# EAGLE design B104C (EAGLE 6.6.0)
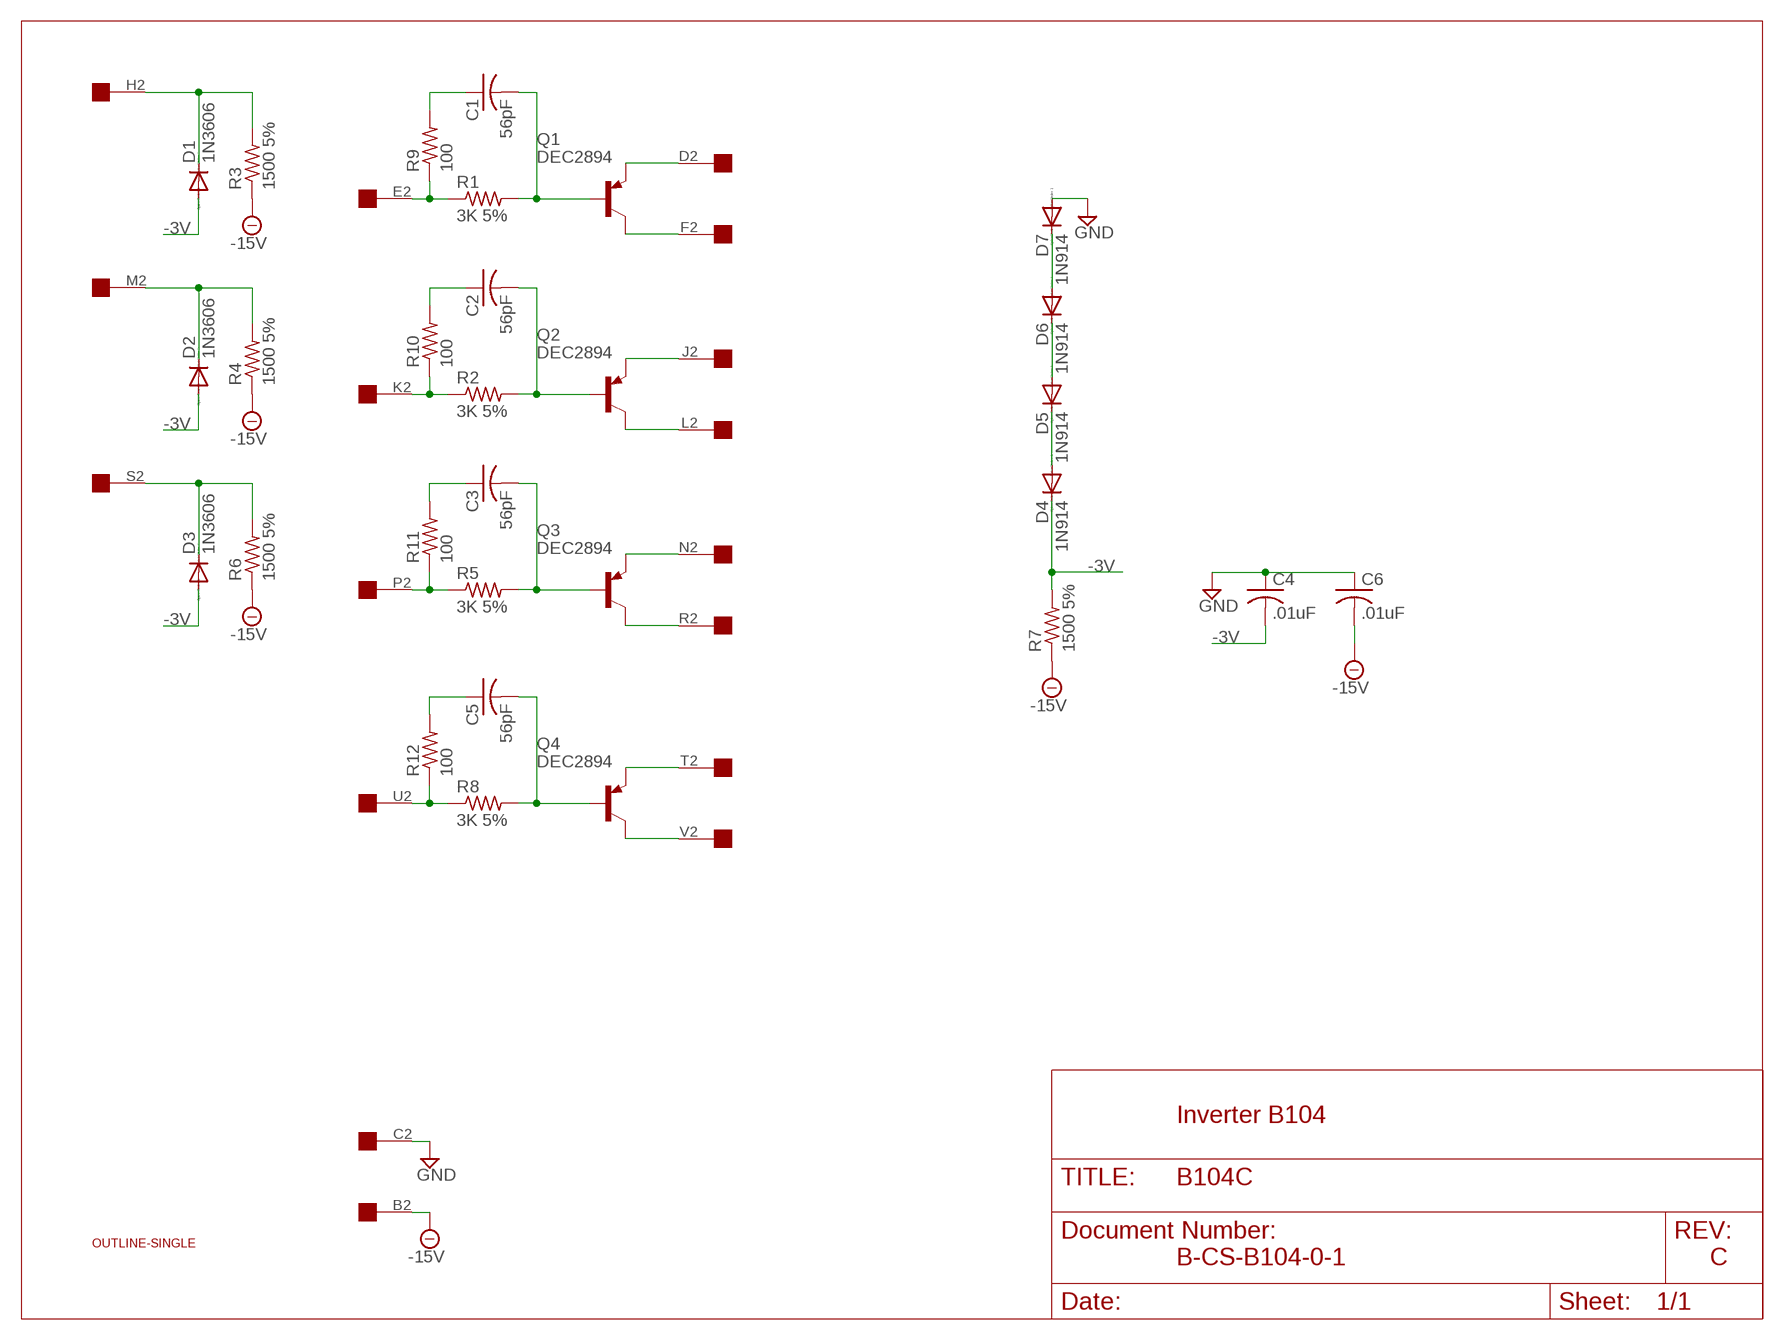
[diagram p0: schematic, sheet 1]

## Parts
C1  56pF  C-US150-054X183  [C150-054X183]
C2  56pF  C-US150-054X183  [C150-054X183]
C3  56pF  C-US150-054X183  [C150-054X183]
C4  .01uF  C-US150-054X183  [C150-054X183]
C5  56pF  C-US150-054X183  [C150-054X183]
C6  .01uF  C-US150-054X183  [C150-054X183]
D1  1N3606  1N4148DO35-10  [DO35-10]
D2  1N3606  1N4148DO35-10  [DO35-10]
D3  1N3606  1N4148DO35-10  [DO35-10]
D4  1N914  1N4148DO35-10  [DO35-10]
D5  1N914  1N4148DO35-10  [DO35-10]
D6  1N914  1N4148DO35-10  [DO35-10]
D7  1N914  1N4148DO35-10  [DO35-10]
Q1  DEC2894  2N2904  [TO39]
Q2  DEC2894  2N2904  [TO39]
Q3  DEC2894  2N2904  [TO39]
Q4  DEC2894  2N2904  [TO39]
R1  3K 5%  R-US_0207/10  [0207/10]
R2  3K 5%  R-US_0207/10  [0207/10]
R3  1500 5%  R-US_0207/10  [0207/10]
R4  1500 5%  R-US_0207/10  [0207/10]
R5  3K 5%  R-US_0207/10  [0207/10]
R6  1500 5%  R-US_0207/10  [0207/10]
R7  1500 5%  R-US_0207/10  [0207/10]
R8  3K 5%  R-US_0207/10  [0207/10]
R9  100  R-US_0207/10  [0207/10]
R10  100  R-US_0207/10  [0207/10]
R11  100  R-US_0207/10  [0207/10]
R12  100  R-US_0207/10  [0207/10]
U$1  OUTLINE-SINGLE  [SINGLE]
U$2  EDGE-1  [EDGE-CON1]

## Nets
-3V [Supply]: C4.2 D1.A D2.A D3.A D4.C R7.2
-15V: C6.2 R3.1 R4.1 R6.1 R7.1 U$2.B2
GND [Supply]: C4.1 C6.1 D7.A U$2.C2
N$1: C1.1 R9.2
N$2: Q1.1(E) U$2.D2
N$3: C1.2 Q1.2(B) R1.2
N$4: Q1.3(C) U$2.F2
N$5: D1.C R3.2 U$2.H2
N$6: C2.1 R10.2
N$7: Q2.1(E) U$2.J2
N$8: C2.2 Q2.2(B) R2.2
N$9: Q2.3(C) U$2.L2
N$10: D2.C R4.2 U$2.M2
N$11: C3.1 R11.2
N$12: Q3.1(E) U$2.N2
N$13: C3.2 Q3.2(B) R5.2
N$14: Q3.3(C) U$2.R2
N$15: D3.C R6.2 U$2.S2
N$16: C5.1 R12.2
N$17: Q4.1(E) U$2.T2
N$18: C5.2 Q4.2(B) R8.2
N$19: Q4.3(C) U$2.V2
N$20: R5.1 R11.1 U$2.P2
N$21: R2.1 R10.1 U$2.K2
N$22: R1.1 R9.1 U$2.E2
N$23: R8.1 R12.1 U$2.U2
N$26: D6.A D7.C
N$27: D5.A D6.C
N$29: D4.A D5.C
Unconnected: U$2.A2

## Notes on the sheet
- Inverter B104
- B-CS-B104-0-1 | C

## Library data of the parts
C1-C6 = rcl:C-US: CAPACITOR, American symbol
D1-D7 = diode:1N4148: DIODE high speed (Philips)
Q1-Q4 = transistor-pnp:2N2904*: PNP Transistror
R1-R12 = rcl:R-US_: RESISTOR, American symbol
U$1 = dec-con:OUTLINE-*: Board outlines for DEC boards.
U$2 = dec-con:EDGE-1: Single-Sided DEC Edge Connector -- (side 2)

## Net classes
0 default: width 0.813 mm
1 Supply: width 0.813 mm

## Board
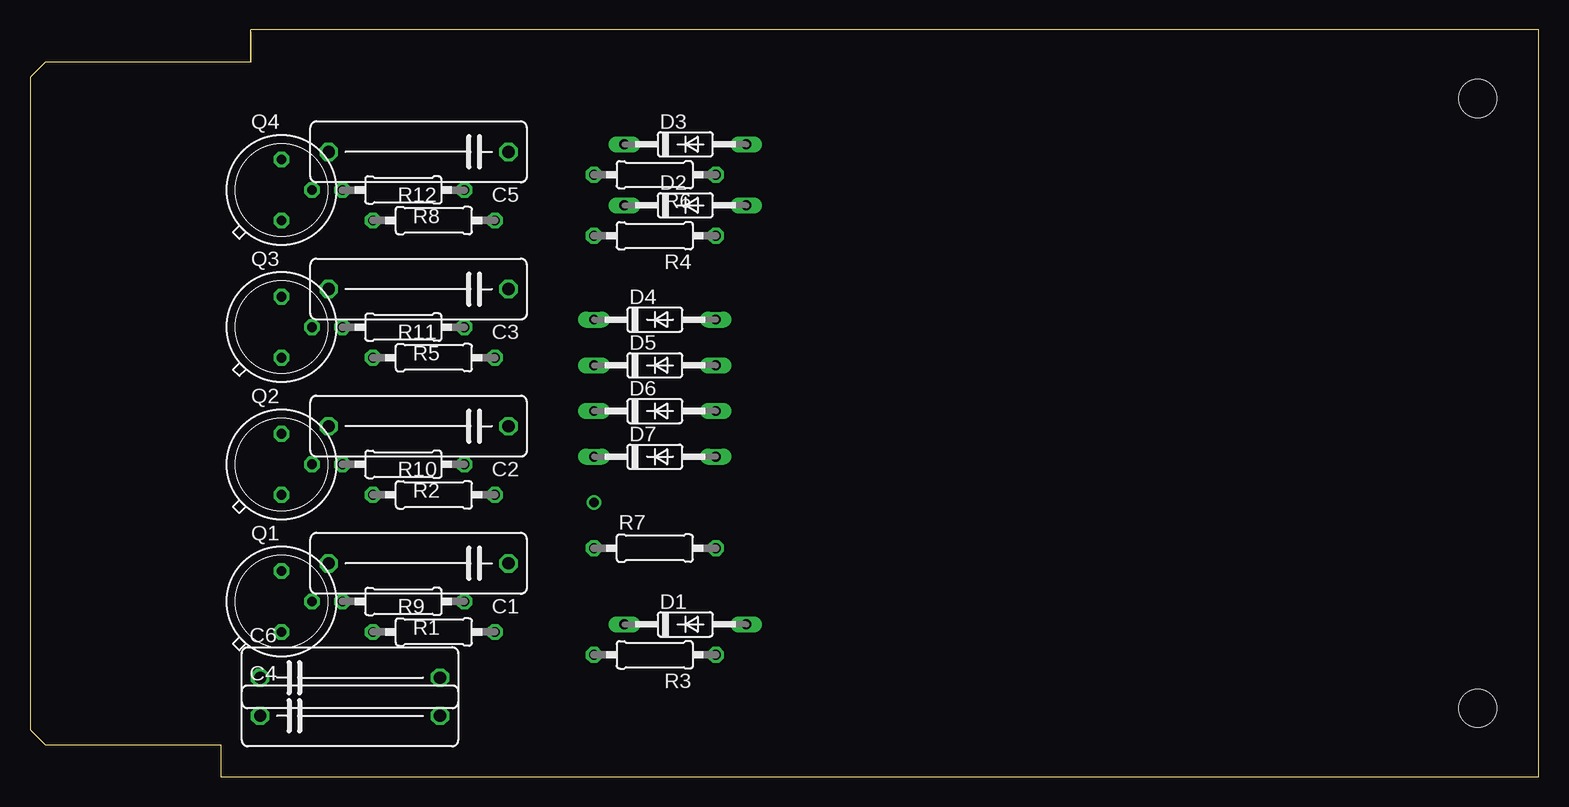
[diagram p1: board, top side]
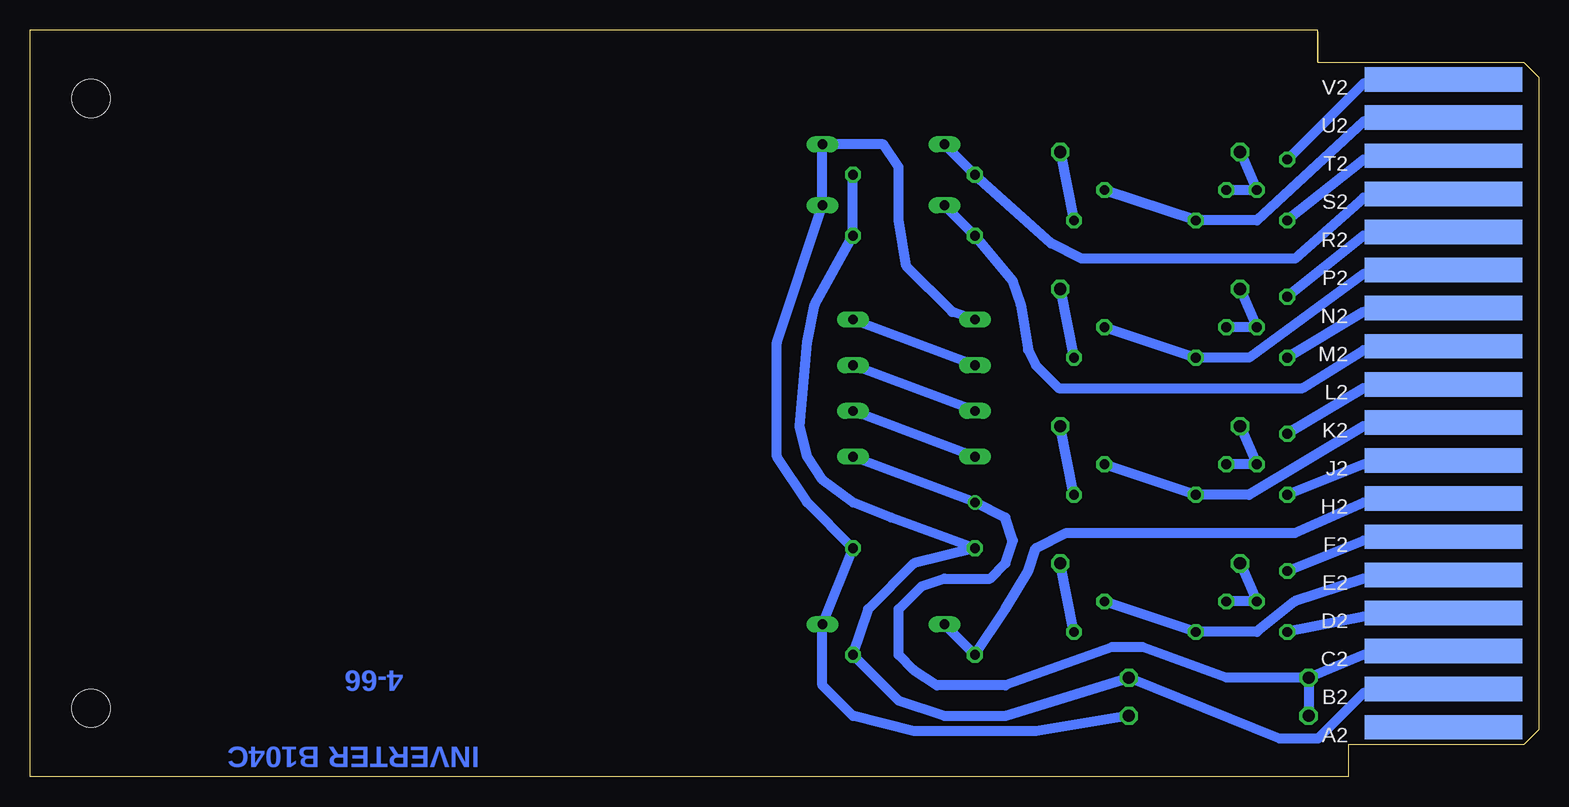
[diagram p2: board, bottom side, seen from below]

Size 125.73 x 62.23 mm. Coordinates in mm from the lower left corner, seen from the top.
Copper layers (1+16): Top 0.035mm / dielectric 1.5mm / Bottom 0.035mm
Design rules "16mils": minimum track width 16mil, minimum drill 32mil, track to track 15mil, track to pad 10mil, pad to pad 10mil, via to via 10mil, smd to smd 10mil, copper to edge 13mil, drill to drill 10mil, minimum pad ring 10mil, minimum via ring 8mil, stop-mask expansion 0mil, vias tented up to drill 0mil, thermal gap 10mil

### Footprints (pad centres in the part's own frame; a part is rotated, then mirrored left to right if it is on the bottom)
C150-054X183 = drill 1.016 octagon: 1 -7.493,0; 2 7.493,0
DO35-10 = drill 0.813 long: A 5.08,0; C -5.08,0
TO39 = drill 0.813 octagon: 1 0,-2.54; 2 2.54,0; 3 0,2.54
0207/10 = drill 0.813 octagon: 1 -5.08,0; 2 5.08,0
SINGLE = hole 3.175: 120.65,56.515; 120.65,5.715
EDGE-CON1 = smd 13.106 x 2.032 bottom: A2 7.938,4.128; B2 7.938,7.303; C2 7.938,10.477; D2 7.938,13.652; E2 7.938,16.828; F2 7.938,20.003; H2 7.938,23.177; J2 7.938,26.352; K2 7.938,29.527; L2 7.938,32.703; M2 7.938,35.877; N2 7.938,39.053; P2 7.938,42.227; R2 7.938,45.403; S2 7.938,48.578; T2 7.938,51.752; U2 7.938,54.928; V2 7.938,58.102

### Placement (x,y rotation side)
C1  32.39,17.78 180 top
C2  32.39,29.21 180 top
C3  32.39,40.64 180 top
C4  26.67,5.08 0 top
C5  32.39,52.07 180 top
C6  26.67,8.26 0 top
D1  54.61,12.7 0 top
D2  54.61,47.62 0 top
D3  54.61,52.7 0 top
D4  52.07,38.1 0 top
D5  52.07,34.29 0 top
D6  52.07,30.48 0 top
D7  52.07,26.67 0 top
Q1  20.96,14.61 0 top
Q2  20.96,26.04 0 top
Q3  20.96,37.47 0 top
Q4  20.96,48.9 0 top
R1  31.12,14.61 180 top
R2  31.12,26.04 180 top
R3  52.07,10.16 180 top
R4  52.07,45.09 180 top
R5  31.12,37.47 180 top
R6  52.07,50.16 180 top
R7  52.07,19.05 0 top
R8  31.12,48.9 180 top
R9  33.66,12.06 0 top
R10  33.66,23.5 0 top
R11  33.66,34.92 0 top
R12  33.66,46.35 0 top
U$1  0,0 0 top
U$2  0,0 0 top

### Tracks (layer width: path | path; a pad name or v marks a point on that pad's centre or on a via)
-3V
  Bottom 0.813: C4.2 41.91,3.81 52.07,3.81 57.15,5.08 59.69,7.62 D1.A R7.2 60.96,22.86 63.5,26.67 63.5,36.2 D2.A D3.A 54.61,52.7 53.34,50.8 53.34,46.35 52.71,42.55 48.9,38.73 D4.C
-15V
  Bottom 0.813: U$2.B2 8.26,6.99 14.61,6.99 18.42,3.17 21.59,3.17 C6.2 44.45,5.08 49.53,5.08 53.34,6.35 R3.1 55.88,13.97 52.07,17.78 R7.1 53.98,21.59 57.15,22.86 59.69,24.77 60.96,26.67 61.6,29.21 60.96,36.2 60.33,39.37 R4.1 R6.1
GND  (via drill 0.81)
  Bottom 0.813: C6.1 C4.1 | U$2.C2 8.89,10.16 14.61,10.16 C6.1 | C6.1 26.04,8.26 33.02,10.79 35.56,10.79 44.45,7.62 50.17,7.62 52.07,8.89 53.34,10.16 53.34,13.97 51.44,15.88 49.53,16.51 45.72,16.51 44.45,17.78 43.82,19.68 44.45,21.59 v46.99,22.86 D7.A
N$1
  Bottom 0.813: R9.2 C1.1
N$2
  Bottom 0.813: U$2.D2 8.89,13.34 14.61,13.34 Q1.1
N$3
  Bottom 0.813: Q1.2 R1.2 Q1.2 | C1.2 Q1.2
N$4
  Bottom 0.813: U$2.F2 8.89,19.68 14.61,19.68 Q1.3
N$5
  Bottom 0.813: D1.C R3.2 44.45,13.97 42.55,17.14 41.91,19.05 39.37,20.32 20.32,20.32 14.61,22.86 8.26,22.86 U$2.H2
N$6
  Bottom 0.813: R10.2 C2.1
N$7
  Bottom 0.813: U$2.J2 8.26,26.04 14.61,26.04 Q2.1
N$8
  Bottom 0.813: Q2.2 R2.2 Q2.2 | C2.2 Q2.2
N$9
  Bottom 0.813: U$2.L2 8.26,32.38 14.61,32.38 Q2.3
N$10
  Bottom 0.813: D2.C R4.2 43.82,41.27 43.18,39.37 42.55,35.56 41.91,34.29 40.01,32.38 19.69,32.38 14.61,35.56 8.89,35.56 U$2.M2
N$11
  Bottom 0.813: C3.1 R11.2
N$12
  Bottom 0.813: U$2.N2 8.26,38.73 14.61,38.73 Q3.1
N$13
  Bottom 0.813: C3.2 Q3.2 | Q3.2 R5.2 Q3.2
N$14
  Bottom 0.813: U$2.R2 8.26,45.09 14.61,45.09 Q3.3
N$15
  Bottom 0.813: D3.C R6.2 40.64,44.45 38.1,43.18 20.32,43.18 14.61,48.26 8.26,48.26 U$2.S2
N$16
  Bottom 0.813: C5.1 R12.2
N$17
  Bottom 0.813: U$2.T2 8.89,51.44 14.61,51.44 Q4.1
N$18
  Bottom 0.813: C5.2 Q4.2 R8.2
N$19
  Bottom 0.813: U$2.V2 8.26,57.78 14.61,57.78 Q4.3
N$20
  Bottom 0.813: R5.1 R11.1 24.13,34.92 14.61,41.91 8.89,41.91 U$2.P2
N$21
  Bottom 0.813: R2.1 R10.1 24.13,23.5 14.61,29.21 8.89,29.21 U$2.K2
N$22
  Bottom 0.813: R1.1 R9.1 23.5,12.06 20.32,14.61 14.61,16.51 8.89,16.51 U$2.E2
N$23
  Bottom 0.813: R8.1 R12.1 23.5,46.35 14.61,54.61 8.89,54.61 U$2.U2
N$26
  Bottom 0.813: D7.C D6.A
N$27
  Bottom 0.813: D6.C D5.A
N$29
  Bottom 0.813: D5.C D4.A

### Text on the board
Bottom: 4-66 | INVERTER B104C
200bmp: C:/Users/Vince/Documents/eagle/projects/DEC/Bxxx/B104/B104Cbackfb.bmp